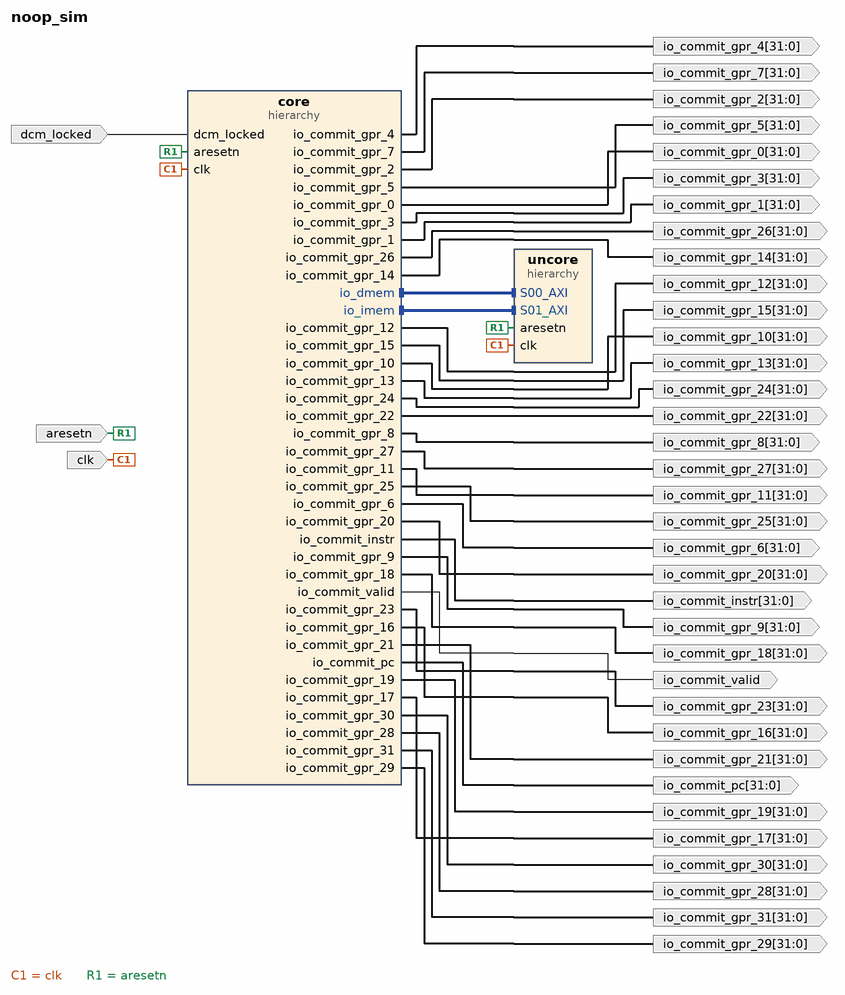
[diagram p0: block diagram of the top level]
# Vivado block design noop_sim, xc7a200tfbg676-2, Vivado 2018.1
create_bd_design noop_sim

create_bd_port -dir I -type clk clk
set_property -dict {CONFIG.FREQ_HZ 50000000 CONFIG.CLK_DOMAIN noop_sim_clk} [get_bd_ports clk]
create_bd_port -dir I -type rst aresetn
create_bd_port -dir O -from 31 -to 0 io_commit_gpr_26
create_bd_port -dir O -from 31 -to 0 io_commit_gpr_7
create_bd_port -dir O -from 31 -to 0 io_commit_gpr_4
create_bd_port -dir O io_commit_valid
create_bd_port -dir O -from 31 -to 0 io_commit_instr
create_bd_port -dir O -from 31 -to 0 io_commit_gpr_27
create_bd_port -dir O -from 31 -to 0 io_commit_gpr_5
create_bd_port -dir O -from 31 -to 0 io_commit_gpr_24
create_bd_port -dir O -from 31 -to 0 io_commit_gpr_25
create_bd_port -dir O -from 31 -to 0 io_commit_gpr_2
create_bd_port -dir O -from 31 -to 0 io_commit_gpr_22
create_bd_port -dir O -from 31 -to 0 io_commit_gpr_14
create_bd_port -dir O -from 31 -to 0 io_commit_pc
create_bd_port -dir O -from 31 -to 0 io_commit_gpr_3
create_bd_port -dir O -from 31 -to 0 io_commit_gpr_0
create_bd_port -dir O -from 31 -to 0 io_commit_gpr_15
create_bd_port -dir O -from 31 -to 0 io_commit_gpr_23
create_bd_port -dir O -from 31 -to 0 io_commit_gpr_20
create_bd_port -dir O -from 31 -to 0 io_commit_gpr_12
create_bd_port -dir O -from 31 -to 0 io_commit_gpr_1
create_bd_port -dir O -from 31 -to 0 io_commit_gpr_13
create_bd_port -dir O -from 31 -to 0 io_commit_gpr_21
create_bd_port -dir O -from 31 -to 0 io_commit_gpr_18
create_bd_port -dir O -from 31 -to 0 io_commit_gpr_10
create_bd_port -dir O -from 31 -to 0 io_commit_gpr_30
create_bd_port -dir O -from 31 -to 0 io_commit_gpr_11
create_bd_port -dir O -from 31 -to 0 io_commit_gpr_19
create_bd_port -dir O -from 31 -to 0 io_commit_gpr_16
create_bd_port -dir O -from 31 -to 0 io_commit_gpr_8
create_bd_port -dir O -from 31 -to 0 io_commit_gpr_31
create_bd_port -dir O -from 31 -to 0 io_commit_gpr_28
create_bd_port -dir O -from 31 -to 0 io_commit_gpr_9
create_bd_port -dir O -from 31 -to 0 io_commit_gpr_17
create_bd_port -dir O -from 31 -to 0 io_commit_gpr_6
create_bd_port -dir O -from 31 -to 0 io_commit_gpr_29
create_bd_port -dir I dcm_locked

create_bd_cell -type hier core
create_bd_cell -type hier uncore

# ---- hierarchy /core ----
current_bd_instance /core
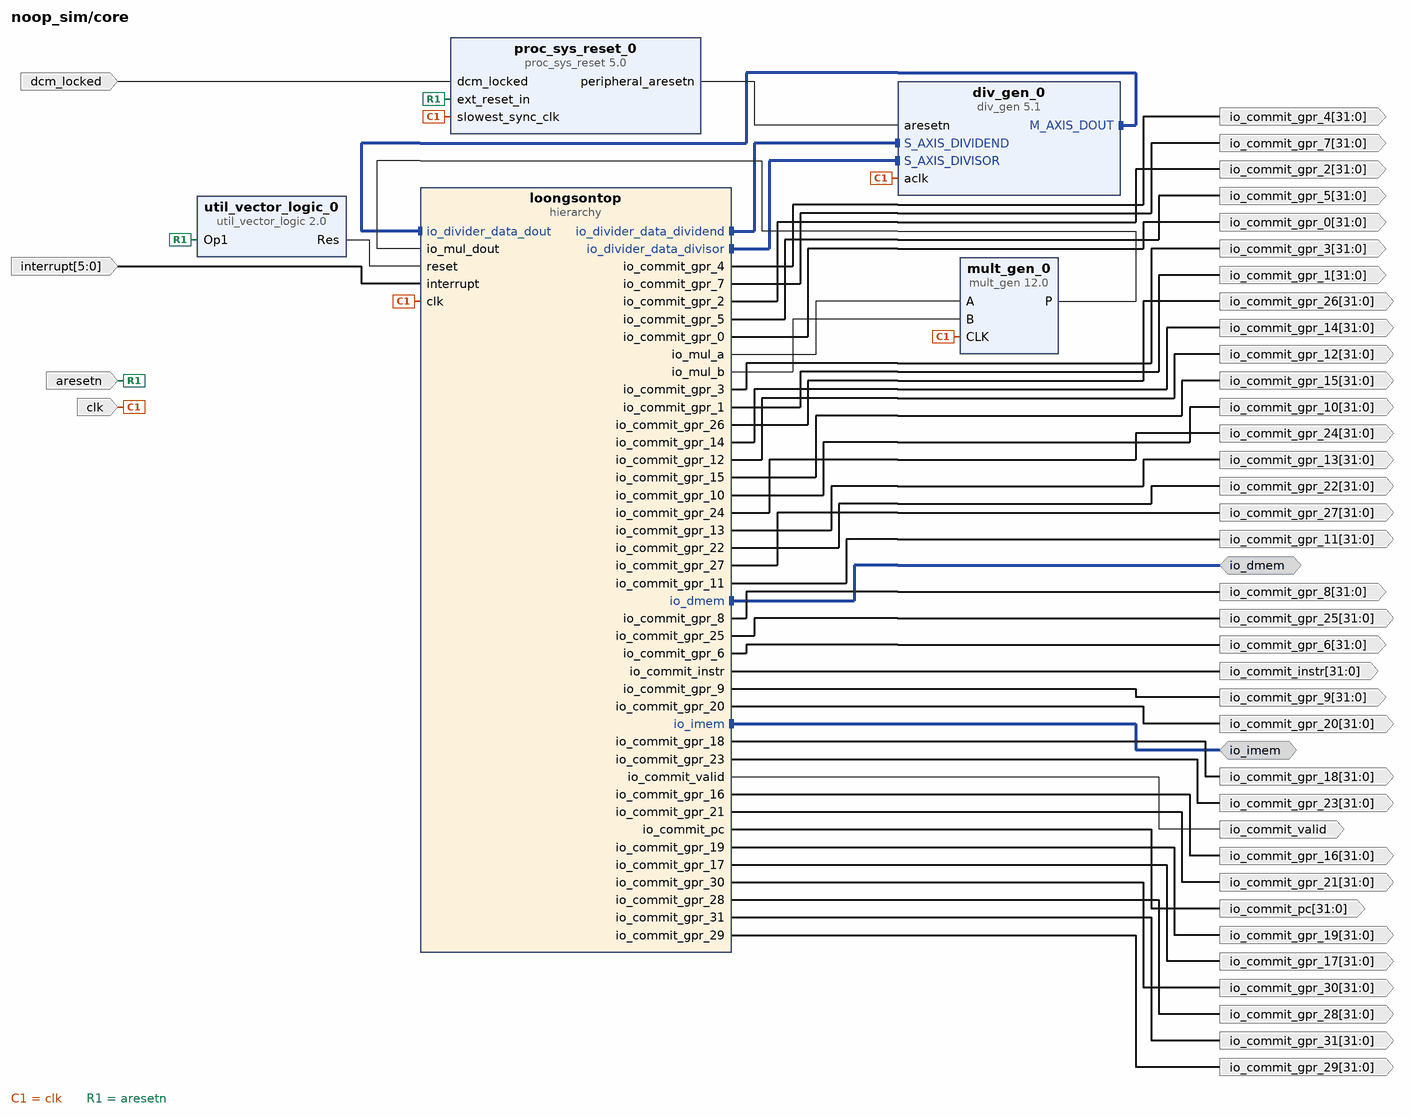
[diagram p1: block diagram inside /core]
create_bd_intf_pin -mode Master -vlnv xilinx.com:interface:aximm_rtl:1.0 io_dmem
create_bd_intf_pin -mode Master -vlnv xilinx.com:interface:aximm_rtl:1.0 io_imem
create_bd_pin -dir I -type clk clk
create_bd_pin -dir I -from 5 -to 0 interrupt
create_bd_pin -dir I -type rst aresetn
create_bd_pin -dir I dcm_locked
create_bd_pin -dir O -from 31 -to 0 io_commit_gpr_26
create_bd_pin -dir O -from 31 -to 0 io_commit_gpr_7
create_bd_pin -dir O -from 31 -to 0 io_commit_gpr_4
create_bd_pin -dir O io_commit_valid
create_bd_pin -dir O -from 31 -to 0 io_commit_instr
create_bd_pin -dir O -from 31 -to 0 io_commit_gpr_27
create_bd_pin -dir O -from 31 -to 0 io_commit_gpr_5
create_bd_pin -dir O -from 31 -to 0 io_commit_gpr_24
create_bd_pin -dir O -from 31 -to 0 io_commit_gpr_25
create_bd_pin -dir O -from 31 -to 0 io_commit_gpr_2
create_bd_pin -dir O -from 31 -to 0 io_commit_gpr_22
create_bd_pin -dir O -from 31 -to 0 io_commit_gpr_14
create_bd_pin -dir O -from 31 -to 0 io_commit_pc
create_bd_pin -dir O -from 31 -to 0 io_commit_gpr_3
create_bd_pin -dir O -from 31 -to 0 io_commit_gpr_0
create_bd_pin -dir O -from 31 -to 0 io_commit_gpr_15
create_bd_pin -dir O -from 31 -to 0 io_commit_gpr_23
create_bd_pin -dir O -from 31 -to 0 io_commit_gpr_20
create_bd_pin -dir O -from 31 -to 0 io_commit_gpr_12
create_bd_pin -dir O -from 31 -to 0 io_commit_gpr_1
create_bd_pin -dir O -from 31 -to 0 io_commit_gpr_13
create_bd_pin -dir O -from 31 -to 0 io_commit_gpr_21
create_bd_pin -dir O -from 31 -to 0 io_commit_gpr_18
create_bd_pin -dir O -from 31 -to 0 io_commit_gpr_10
create_bd_pin -dir O -from 31 -to 0 io_commit_gpr_30
create_bd_pin -dir O -from 31 -to 0 io_commit_gpr_11
create_bd_pin -dir O -from 31 -to 0 io_commit_gpr_19
create_bd_pin -dir O -from 31 -to 0 io_commit_gpr_16
create_bd_pin -dir O -from 31 -to 0 io_commit_gpr_8
create_bd_pin -dir O -from 31 -to 0 io_commit_gpr_31
create_bd_pin -dir O -from 31 -to 0 io_commit_gpr_28
create_bd_pin -dir O -from 31 -to 0 io_commit_gpr_9
create_bd_pin -dir O -from 31 -to 0 io_commit_gpr_17
create_bd_pin -dir O -from 31 -to 0 io_commit_gpr_6
create_bd_pin -dir O -from 31 -to 0 io_commit_gpr_29

create_bd_cell -type ip -vlnv xilinx.com:ip:util_vector_logic:2.0 util_vector_logic_0
set_property -dict {CONFIG.C_SIZE 1 CONFIG.C_OPERATION not} [get_bd_cells util_vector_logic_0]
create_bd_cell -type ip -vlnv xilinx.com:ip:mult_gen:12.0 mult_gen_0
set_property -dict [list \
  CONFIG.PortAType Signed \
  CONFIG.PortAWidth 33 \
  CONFIG.PortBWidth 33 \
  CONFIG.Multiplier_Construction Use_Mults \
  CONFIG.OptGoal Area \
  CONFIG.PipeStages 3 \
] [get_bd_cells mult_gen_0]
create_bd_cell -type ip -vlnv xilinx.com:ip:div_gen:5.1 div_gen_0
set_property -dict [list \
  CONFIG.dividend_and_quotient_width 40 \
  CONFIG.divisor_width 40 \
  CONFIG.fractional_width 40 \
  CONFIG.clocks_per_division 8 \
  CONFIG.FlowControl Blocking \
  CONFIG.OptimizeGoal Resources \
  CONFIG.latency 46 \
  CONFIG.ARESETN true \
] [get_bd_cells div_gen_0]
create_bd_cell -type ip -vlnv xilinx.com:ip:proc_sys_reset:5.0 proc_sys_reset_0
create_bd_cell -type hier loongsontop

# ---- hierarchy /core/loongsontop ----
current_bd_instance /core/loongsontop
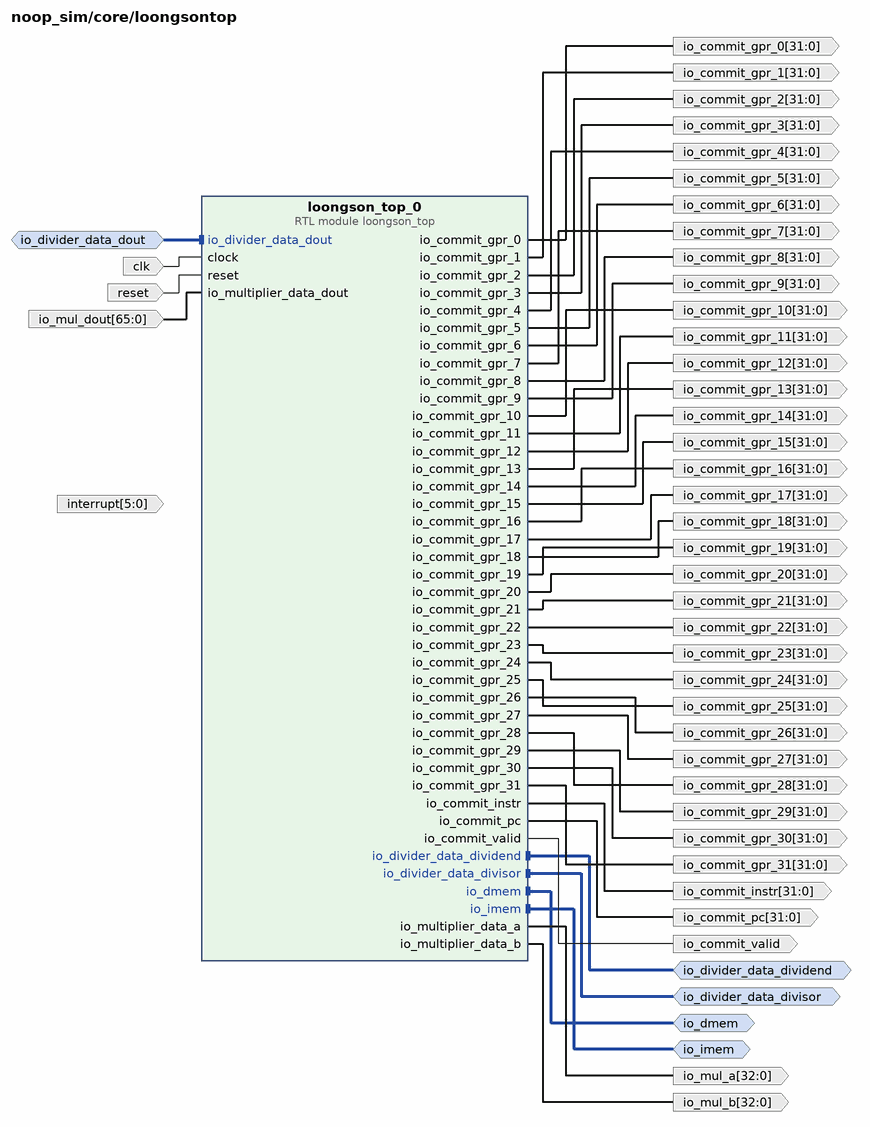
[diagram p2: block diagram inside /core/loongsontop]
create_bd_intf_pin -mode Master -vlnv xilinx.com:interface:aximm_rtl:1.0 io_dmem
create_bd_intf_pin -mode Master -vlnv xilinx.com:interface:aximm_rtl:1.0 io_imem
create_bd_intf_pin -mode Master -vlnv xilinx.com:interface:axis_rtl:1.0 io_divider_data_dividend
create_bd_intf_pin -mode Master -vlnv xilinx.com:interface:axis_rtl:1.0 io_divider_data_divisor
create_bd_intf_pin -mode Slave -vlnv xilinx.com:interface:axis_rtl:1.0 io_divider_data_dout
create_bd_pin -dir I -type clk clk
create_bd_pin -dir I -type rst reset
create_bd_pin -dir O -from 32 -to 0 io_mul_a
create_bd_pin -dir O -from 32 -to 0 io_mul_b
create_bd_pin -dir I -from 65 -to 0 io_mul_dout
create_bd_pin -dir I -from 5 -to 0 interrupt
create_bd_pin -dir O -from 31 -to 0 io_commit_gpr_26
create_bd_pin -dir O -from 31 -to 0 io_commit_gpr_7
create_bd_pin -dir O -from 31 -to 0 io_commit_gpr_4
create_bd_pin -dir O io_commit_valid
create_bd_pin -dir O -from 31 -to 0 io_commit_instr
create_bd_pin -dir O -from 31 -to 0 io_commit_gpr_27
create_bd_pin -dir O -from 31 -to 0 io_commit_gpr_5
create_bd_pin -dir O -from 31 -to 0 io_commit_gpr_24
create_bd_pin -dir O -from 31 -to 0 io_commit_gpr_25
create_bd_pin -dir O -from 31 -to 0 io_commit_gpr_2
create_bd_pin -dir O -from 31 -to 0 io_commit_gpr_22
create_bd_pin -dir O -from 31 -to 0 io_commit_gpr_14
create_bd_pin -dir O -from 31 -to 0 io_commit_pc
create_bd_pin -dir O -from 31 -to 0 io_commit_gpr_3
create_bd_pin -dir O -from 31 -to 0 io_commit_gpr_0
create_bd_pin -dir O -from 31 -to 0 io_commit_gpr_15
create_bd_pin -dir O -from 31 -to 0 io_commit_gpr_23
create_bd_pin -dir O -from 31 -to 0 io_commit_gpr_20
create_bd_pin -dir O -from 31 -to 0 io_commit_gpr_12
create_bd_pin -dir O -from 31 -to 0 io_commit_gpr_1
create_bd_pin -dir O -from 31 -to 0 io_commit_gpr_13
create_bd_pin -dir O -from 31 -to 0 io_commit_gpr_21
create_bd_pin -dir O -from 31 -to 0 io_commit_gpr_18
create_bd_pin -dir O -from 31 -to 0 io_commit_gpr_10
create_bd_pin -dir O -from 31 -to 0 io_commit_gpr_30
create_bd_pin -dir O -from 31 -to 0 io_commit_gpr_11
create_bd_pin -dir O -from 31 -to 0 io_commit_gpr_19
create_bd_pin -dir O -from 31 -to 0 io_commit_gpr_16
create_bd_pin -dir O -from 31 -to 0 io_commit_gpr_8
create_bd_pin -dir O -from 31 -to 0 io_commit_gpr_31
create_bd_pin -dir O -from 31 -to 0 io_commit_gpr_28
create_bd_pin -dir O -from 31 -to 0 io_commit_gpr_9
create_bd_pin -dir O -from 31 -to 0 io_commit_gpr_17
create_bd_pin -dir O -from 31 -to 0 io_commit_gpr_6
create_bd_pin -dir O -from 31 -to 0 io_commit_gpr_29

create_bd_cell -type module -reference loongson_top loongson_top_0

# ---- hierarchy /uncore ----
current_bd_instance /uncore
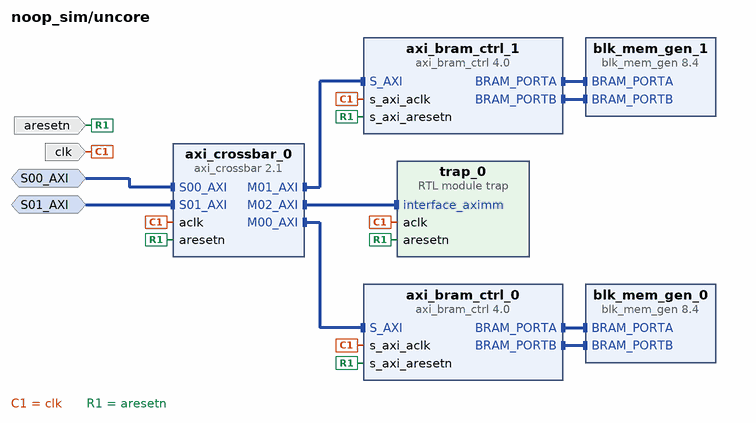
[diagram p3: block diagram inside /uncore]
create_bd_intf_pin -mode Slave -vlnv xilinx.com:interface:aximm_rtl:1.0 S00_AXI
create_bd_intf_pin -mode Slave -vlnv xilinx.com:interface:aximm_rtl:1.0 S01_AXI
create_bd_pin -dir I -type clk clk
create_bd_pin -dir I -type rst aresetn

create_bd_cell -type ip -vlnv xilinx.com:ip:axi_bram_ctrl:4.0 axi_bram_ctrl_0
set_property -dict {CONFIG.SINGLE_PORT_BRAM 0} [get_bd_cells axi_bram_ctrl_0]
create_bd_cell -type ip -vlnv xilinx.com:ip:axi_crossbar:2.1 axi_crossbar_0
set_property -dict [list \
  CONFIG.ADDR_RANGES 1 \
  CONFIG.NUM_SI 2 \
  CONFIG.NUM_MI 3 \
  CONFIG.M00_A00_BASE_ADDR 0x0000000000000000 \
  CONFIG.M00_A01_BASE_ADDR 0x000000001FC00000 \
  CONFIG.M01_A00_BASE_ADDR 0x000000001fc00000 \
  CONFIG.M02_A00_BASE_ADDR 0x0000000010000000 \
  CONFIG.M00_A00_ADDR_WIDTH 20 \
  CONFIG.M00_A01_ADDR_WIDTH 20 \
  CONFIG.M01_A00_ADDR_WIDTH 20 \
  CONFIG.M02_A00_ADDR_WIDTH 12 \
] [get_bd_cells axi_crossbar_0]
create_bd_cell -type ip -vlnv xilinx.com:ip:blk_mem_gen:8.4 blk_mem_gen_0
set_property -dict [list \
  CONFIG.Memory_Type True_Dual_Port_RAM \
  CONFIG.Enable_32bit_Address true \
  CONFIG.Write_Width_A 32 \
  CONFIG.Write_Depth_A 4096 \
  CONFIG.Read_Width_A 32 \
  CONFIG.Operating_Mode_A READ_FIRST \
  CONFIG.Write_Width_B 32 \
  CONFIG.Read_Width_B 32 \
  CONFIG.Operating_Mode_B READ_FIRST \
  CONFIG.Enable_B Use_ENB_Pin \
  CONFIG.Register_PortA_Output_of_Memory_Primitives false \
  CONFIG.Register_PortB_Output_of_Memory_Primitives false \
  CONFIG.Load_Init_File true \
  CONFIG.Coe_File ../../ddr.coe \
  CONFIG.Fill_Remaining_Memory_Locations false \
  CONFIG.Use_RSTA_Pin false \
  CONFIG.Use_RSTB_Pin false \
  CONFIG.Port_B_Clock 100 \
  CONFIG.Port_B_Write_Rate 50 \
  CONFIG.Port_B_Enable_Rate 100 \
  CONFIG.use_bram_block Stand_Alone \
] [get_bd_cells blk_mem_gen_0]
create_bd_cell -type ip -vlnv xilinx.com:ip:blk_mem_gen:8.4 blk_mem_gen_1
set_property -dict [list \
  CONFIG.Memory_Type True_Dual_Port_RAM \
  CONFIG.Enable_32bit_Address true \
  CONFIG.Write_Width_A 32 \
  CONFIG.Write_Depth_A 4096 \
  CONFIG.Read_Width_A 32 \
  CONFIG.Operating_Mode_A READ_FIRST \
  CONFIG.Write_Width_B 32 \
  CONFIG.Read_Width_B 32 \
  CONFIG.Operating_Mode_B READ_FIRST \
  CONFIG.Enable_B Use_ENB_Pin \
  CONFIG.Register_PortA_Output_of_Memory_Primitives false \
  CONFIG.Register_PortB_Output_of_Memory_Primitives false \
  CONFIG.Load_Init_File true \
  CONFIG.Coe_File ../../bram.coe \
  CONFIG.Fill_Remaining_Memory_Locations false \
  CONFIG.Use_RSTA_Pin false \
  CONFIG.Use_RSTB_Pin false \
  CONFIG.Port_B_Clock 100 \
  CONFIG.Port_B_Write_Rate 50 \
  CONFIG.Port_B_Enable_Rate 100 \
  CONFIG.use_bram_block Stand_Alone \
] [get_bd_cells blk_mem_gen_1]
create_bd_cell -type ip -vlnv xilinx.com:ip:axi_bram_ctrl:4.0 axi_bram_ctrl_1
set_property -dict {CONFIG.SINGLE_PORT_BRAM 0} [get_bd_cells axi_bram_ctrl_1]
create_bd_cell -type module -reference trap trap_0

# ---- connections ----

current_bd_instance /core
connect_bd_intf_net [get_bd_intf_pins loongsontop/io_divider_data_dividend] [get_bd_intf_pins div_gen_0/S_AXIS_DIVIDEND]
connect_bd_intf_net [get_bd_intf_pins loongsontop/io_divider_data_divisor] [get_bd_intf_pins div_gen_0/S_AXIS_DIVISOR]
connect_bd_intf_net [get_bd_intf_pins loongsontop/io_divider_data_dout] [get_bd_intf_pins div_gen_0/M_AXIS_DOUT]
connect_bd_intf_net -intf_net loongson_top_0_io_dmem1 [get_bd_intf_pins io_dmem] [get_bd_intf_pins loongsontop/io_dmem]
connect_bd_intf_net -intf_net loongson_top_0_io_imem1 [get_bd_intf_pins io_imem] [get_bd_intf_pins loongsontop/io_imem]
connect_bd_net [get_bd_pins util_vector_logic_0/Res] [get_bd_pins loongsontop/reset]
connect_bd_net -net loongson_top_0_io_mul_a [get_bd_pins loongsontop/io_mul_a] [get_bd_pins mult_gen_0/A]
connect_bd_net -net loongson_top_0_io_mul_b [get_bd_pins loongsontop/io_mul_b] [get_bd_pins mult_gen_0/B]
connect_bd_net [get_bd_pins mult_gen_0/P] [get_bd_pins loongsontop/io_mul_dout]
connect_bd_net [get_bd_pins proc_sys_reset_0/peripheral_aresetn] [get_bd_pins div_gen_0/aresetn]
connect_bd_net [get_bd_pins clk] \
  [get_bd_pins div_gen_0/aclk] [get_bd_pins mult_gen_0/CLK] [get_bd_pins proc_sys_reset_0/slowest_sync_clk] \
  [get_bd_pins loongsontop/clk]
connect_bd_net [get_bd_pins interrupt] [get_bd_pins loongsontop/interrupt]
connect_bd_net [get_bd_pins aresetn] [get_bd_pins proc_sys_reset_0/ext_reset_in] [get_bd_pins util_vector_logic_0/Op1]
connect_bd_net [get_bd_pins dcm_locked] [get_bd_pins proc_sys_reset_0/dcm_locked]
connect_bd_net -net loongsontop_io_commit_gpr_26_0 [get_bd_pins loongsontop/io_commit_gpr_26] [get_bd_pins io_commit_gpr_26]
connect_bd_net -net loongsontop_io_commit_gpr_7_0 [get_bd_pins loongsontop/io_commit_gpr_7] [get_bd_pins io_commit_gpr_7]
connect_bd_net -net loongsontop_io_commit_gpr_4_0 [get_bd_pins loongsontop/io_commit_gpr_4] [get_bd_pins io_commit_gpr_4]
connect_bd_net [get_bd_pins loongsontop/io_commit_valid] [get_bd_pins io_commit_valid]
connect_bd_net [get_bd_pins loongsontop/io_commit_instr] [get_bd_pins io_commit_instr]
connect_bd_net -net loongsontop_io_commit_gpr_27_0 [get_bd_pins loongsontop/io_commit_gpr_27] [get_bd_pins io_commit_gpr_27]
connect_bd_net -net loongsontop_io_commit_gpr_5_0 [get_bd_pins loongsontop/io_commit_gpr_5] [get_bd_pins io_commit_gpr_5]
connect_bd_net -net loongsontop_io_commit_gpr_24_0 [get_bd_pins loongsontop/io_commit_gpr_24] [get_bd_pins io_commit_gpr_24]
connect_bd_net -net loongsontop_io_commit_gpr_25_0 [get_bd_pins loongsontop/io_commit_gpr_25] [get_bd_pins io_commit_gpr_25]
connect_bd_net -net loongsontop_io_commit_gpr_2_0 [get_bd_pins loongsontop/io_commit_gpr_2] [get_bd_pins io_commit_gpr_2]
connect_bd_net -net loongsontop_io_commit_gpr_22_0 [get_bd_pins loongsontop/io_commit_gpr_22] [get_bd_pins io_commit_gpr_22]
connect_bd_net -net loongsontop_io_commit_gpr_14_0 [get_bd_pins loongsontop/io_commit_gpr_14] [get_bd_pins io_commit_gpr_14]
connect_bd_net [get_bd_pins loongsontop/io_commit_pc] [get_bd_pins io_commit_pc]
connect_bd_net -net loongsontop_io_commit_gpr_3_0 [get_bd_pins loongsontop/io_commit_gpr_3] [get_bd_pins io_commit_gpr_3]
connect_bd_net -net loongsontop_io_commit_gpr_0_0 [get_bd_pins loongsontop/io_commit_gpr_0] [get_bd_pins io_commit_gpr_0]
connect_bd_net -net loongsontop_io_commit_gpr_15_0 [get_bd_pins loongsontop/io_commit_gpr_15] [get_bd_pins io_commit_gpr_15]
connect_bd_net -net loongsontop_io_commit_gpr_23_0 [get_bd_pins loongsontop/io_commit_gpr_23] [get_bd_pins io_commit_gpr_23]
connect_bd_net -net loongsontop_io_commit_gpr_20_0 [get_bd_pins loongsontop/io_commit_gpr_20] [get_bd_pins io_commit_gpr_20]
connect_bd_net -net loongsontop_io_commit_gpr_12_0 [get_bd_pins loongsontop/io_commit_gpr_12] [get_bd_pins io_commit_gpr_12]
connect_bd_net -net loongsontop_io_commit_gpr_1_0 [get_bd_pins loongsontop/io_commit_gpr_1] [get_bd_pins io_commit_gpr_1]
connect_bd_net -net loongsontop_io_commit_gpr_13_0 [get_bd_pins loongsontop/io_commit_gpr_13] [get_bd_pins io_commit_gpr_13]
connect_bd_net -net loongsontop_io_commit_gpr_21_0 [get_bd_pins loongsontop/io_commit_gpr_21] [get_bd_pins io_commit_gpr_21]
connect_bd_net -net loongsontop_io_commit_gpr_18_0 [get_bd_pins loongsontop/io_commit_gpr_18] [get_bd_pins io_commit_gpr_18]
connect_bd_net -net loongsontop_io_commit_gpr_10_0 [get_bd_pins loongsontop/io_commit_gpr_10] [get_bd_pins io_commit_gpr_10]
connect_bd_net -net loongsontop_io_commit_gpr_30_0 [get_bd_pins loongsontop/io_commit_gpr_30] [get_bd_pins io_commit_gpr_30]
connect_bd_net -net loongsontop_io_commit_gpr_11_0 [get_bd_pins loongsontop/io_commit_gpr_11] [get_bd_pins io_commit_gpr_11]
connect_bd_net -net loongsontop_io_commit_gpr_19_0 [get_bd_pins loongsontop/io_commit_gpr_19] [get_bd_pins io_commit_gpr_19]
connect_bd_net -net loongsontop_io_commit_gpr_16_0 [get_bd_pins loongsontop/io_commit_gpr_16] [get_bd_pins io_commit_gpr_16]
connect_bd_net -net loongsontop_io_commit_gpr_8_0 [get_bd_pins loongsontop/io_commit_gpr_8] [get_bd_pins io_commit_gpr_8]
connect_bd_net -net loongsontop_io_commit_gpr_31_0 [get_bd_pins loongsontop/io_commit_gpr_31] [get_bd_pins io_commit_gpr_31]
connect_bd_net -net loongsontop_io_commit_gpr_28_0 [get_bd_pins loongsontop/io_commit_gpr_28] [get_bd_pins io_commit_gpr_28]
connect_bd_net -net loongsontop_io_commit_gpr_9_0 [get_bd_pins loongsontop/io_commit_gpr_9] [get_bd_pins io_commit_gpr_9]
connect_bd_net -net loongsontop_io_commit_gpr_17_0 [get_bd_pins loongsontop/io_commit_gpr_17] [get_bd_pins io_commit_gpr_17]
connect_bd_net -net loongsontop_io_commit_gpr_6_0 [get_bd_pins loongsontop/io_commit_gpr_6] [get_bd_pins io_commit_gpr_6]
connect_bd_net -net loongsontop_io_commit_gpr_29_0 [get_bd_pins loongsontop/io_commit_gpr_29] [get_bd_pins io_commit_gpr_29]

current_bd_instance /core/loongsontop
connect_bd_intf_net [get_bd_intf_pins io_dmem] [get_bd_intf_pins loongson_top_0/io_dmem]
connect_bd_intf_net [get_bd_intf_pins io_imem] [get_bd_intf_pins loongson_top_0/io_imem]
connect_bd_intf_net [get_bd_intf_pins io_divider_data_dividend] [get_bd_intf_pins loongson_top_0/io_divider_data_dividend]
connect_bd_intf_net [get_bd_intf_pins io_divider_data_divisor] [get_bd_intf_pins loongson_top_0/io_divider_data_divisor]
connect_bd_intf_net [get_bd_intf_pins io_divider_data_dout] [get_bd_intf_pins loongson_top_0/io_divider_data_dout]
connect_bd_net [get_bd_pins clk] [get_bd_pins loongson_top_0/clock]
connect_bd_net [get_bd_pins reset] [get_bd_pins loongson_top_0/reset]
# net interrupt_1 has one end: interrupt
connect_bd_net [get_bd_pins io_mul_dout] [get_bd_pins loongson_top_0/io_multiplier_data_dout]
connect_bd_net -net loongson_top_0_io_mul_a [get_bd_pins loongson_top_0/io_multiplier_data_a] [get_bd_pins io_mul_a]
connect_bd_net -net loongson_top_0_io_mul_b [get_bd_pins loongson_top_0/io_multiplier_data_b] [get_bd_pins io_mul_b]
connect_bd_net [get_bd_pins loongson_top_0/io_commit_gpr_26] [get_bd_pins io_commit_gpr_26]
connect_bd_net [get_bd_pins loongson_top_0/io_commit_gpr_7] [get_bd_pins io_commit_gpr_7]
connect_bd_net [get_bd_pins loongson_top_0/io_commit_gpr_4] [get_bd_pins io_commit_gpr_4]
connect_bd_net [get_bd_pins loongson_top_0/io_commit_valid] [get_bd_pins io_commit_valid]
connect_bd_net [get_bd_pins loongson_top_0/io_commit_instr] [get_bd_pins io_commit_instr]
connect_bd_net [get_bd_pins loongson_top_0/io_commit_gpr_27] [get_bd_pins io_commit_gpr_27]
connect_bd_net [get_bd_pins loongson_top_0/io_commit_gpr_5] [get_bd_pins io_commit_gpr_5]
connect_bd_net [get_bd_pins loongson_top_0/io_commit_gpr_24] [get_bd_pins io_commit_gpr_24]
connect_bd_net [get_bd_pins loongson_top_0/io_commit_gpr_25] [get_bd_pins io_commit_gpr_25]
connect_bd_net [get_bd_pins loongson_top_0/io_commit_gpr_2] [get_bd_pins io_commit_gpr_2]
connect_bd_net [get_bd_pins loongson_top_0/io_commit_gpr_22] [get_bd_pins io_commit_gpr_22]
connect_bd_net [get_bd_pins loongson_top_0/io_commit_gpr_14] [get_bd_pins io_commit_gpr_14]
connect_bd_net [get_bd_pins loongson_top_0/io_commit_pc] [get_bd_pins io_commit_pc]
connect_bd_net [get_bd_pins loongson_top_0/io_commit_gpr_3] [get_bd_pins io_commit_gpr_3]
connect_bd_net [get_bd_pins loongson_top_0/io_commit_gpr_0] [get_bd_pins io_commit_gpr_0]
connect_bd_net [get_bd_pins loongson_top_0/io_commit_gpr_15] [get_bd_pins io_commit_gpr_15]
connect_bd_net [get_bd_pins loongson_top_0/io_commit_gpr_23] [get_bd_pins io_commit_gpr_23]
connect_bd_net [get_bd_pins loongson_top_0/io_commit_gpr_20] [get_bd_pins io_commit_gpr_20]
connect_bd_net [get_bd_pins loongson_top_0/io_commit_gpr_12] [get_bd_pins io_commit_gpr_12]
connect_bd_net [get_bd_pins loongson_top_0/io_commit_gpr_1] [get_bd_pins io_commit_gpr_1]
connect_bd_net [get_bd_pins loongson_top_0/io_commit_gpr_13] [get_bd_pins io_commit_gpr_13]
connect_bd_net [get_bd_pins loongson_top_0/io_commit_gpr_21] [get_bd_pins io_commit_gpr_21]
connect_bd_net [get_bd_pins loongson_top_0/io_commit_gpr_18] [get_bd_pins io_commit_gpr_18]
connect_bd_net [get_bd_pins loongson_top_0/io_commit_gpr_10] [get_bd_pins io_commit_gpr_10]
connect_bd_net [get_bd_pins loongson_top_0/io_commit_gpr_30] [get_bd_pins io_commit_gpr_30]
connect_bd_net [get_bd_pins loongson_top_0/io_commit_gpr_11] [get_bd_pins io_commit_gpr_11]
connect_bd_net [get_bd_pins loongson_top_0/io_commit_gpr_19] [get_bd_pins io_commit_gpr_19]
connect_bd_net [get_bd_pins loongson_top_0/io_commit_gpr_16] [get_bd_pins io_commit_gpr_16]
connect_bd_net [get_bd_pins loongson_top_0/io_commit_gpr_8] [get_bd_pins io_commit_gpr_8]
connect_bd_net [get_bd_pins loongson_top_0/io_commit_gpr_31] [get_bd_pins io_commit_gpr_31]
connect_bd_net [get_bd_pins loongson_top_0/io_commit_gpr_28] [get_bd_pins io_commit_gpr_28]
connect_bd_net [get_bd_pins loongson_top_0/io_commit_gpr_9] [get_bd_pins io_commit_gpr_9]
connect_bd_net [get_bd_pins loongson_top_0/io_commit_gpr_17] [get_bd_pins io_commit_gpr_17]
connect_bd_net [get_bd_pins loongson_top_0/io_commit_gpr_6] [get_bd_pins io_commit_gpr_6]
connect_bd_net [get_bd_pins loongson_top_0/io_commit_gpr_29] [get_bd_pins io_commit_gpr_29]

current_bd_instance /uncore
connect_bd_intf_net [get_bd_intf_pins axi_bram_ctrl_0/S_AXI] [get_bd_intf_pins axi_crossbar_0/M00_AXI]
connect_bd_intf_net [get_bd_intf_pins axi_bram_ctrl_0/BRAM_PORTA] [get_bd_intf_pins blk_mem_gen_0/BRAM_PORTA]
connect_bd_intf_net [get_bd_intf_pins axi_bram_ctrl_0/BRAM_PORTB] [get_bd_intf_pins blk_mem_gen_0/BRAM_PORTB]
connect_bd_intf_net [get_bd_intf_pins axi_crossbar_0/M02_AXI] [get_bd_intf_pins trap_0/interface_aximm]
connect_bd_intf_net [get_bd_intf_pins axi_crossbar_0/M01_AXI] [get_bd_intf_pins axi_bram_ctrl_1/S_AXI]
connect_bd_intf_net [get_bd_intf_pins axi_bram_ctrl_1/BRAM_PORTA] [get_bd_intf_pins blk_mem_gen_1/BRAM_PORTA]
connect_bd_intf_net [get_bd_intf_pins axi_bram_ctrl_1/BRAM_PORTB] [get_bd_intf_pins blk_mem_gen_1/BRAM_PORTB]
connect_bd_intf_net -intf_net core_io_dmem [get_bd_intf_pins S00_AXI] [get_bd_intf_pins axi_crossbar_0/S00_AXI]
connect_bd_intf_net -intf_net core_io_imem [get_bd_intf_pins S01_AXI] [get_bd_intf_pins axi_crossbar_0/S01_AXI]
connect_bd_net -net clk_0_1 [get_bd_pins clk] \
  [get_bd_pins axi_crossbar_0/aclk] [get_bd_pins axi_bram_ctrl_0/s_axi_aclk] [get_bd_pins axi_bram_ctrl_1/s_axi_aclk] \
  [get_bd_pins trap_0/aclk]
connect_bd_net -net aresetn_0_1 [get_bd_pins aresetn] \
  [get_bd_pins axi_crossbar_0/aresetn] [get_bd_pins axi_bram_ctrl_0/s_axi_aresetn] \
  [get_bd_pins axi_bram_ctrl_1/s_axi_aresetn] [get_bd_pins trap_0/aresetn]

current_bd_instance /
connect_bd_intf_net [get_bd_intf_pins core/io_dmem] [get_bd_intf_pins uncore/S00_AXI]
connect_bd_intf_net [get_bd_intf_pins core/io_imem] [get_bd_intf_pins uncore/S01_AXI]
connect_bd_net -net clk_0_1 [get_bd_ports clk] [get_bd_pins core/clk] [get_bd_pins uncore/clk]
connect_bd_net -net aresetn_0_1 [get_bd_ports aresetn] [get_bd_pins core/aresetn] [get_bd_pins uncore/aresetn]
connect_bd_net -net core_io_commit_gpr_26_0 [get_bd_pins core/io_commit_gpr_26] [get_bd_ports io_commit_gpr_26]
connect_bd_net -net core_io_commit_gpr_7_0 [get_bd_pins core/io_commit_gpr_7] [get_bd_ports io_commit_gpr_7]
connect_bd_net -net core_io_commit_gpr_4_0 [get_bd_pins core/io_commit_gpr_4] [get_bd_ports io_commit_gpr_4]
connect_bd_net [get_bd_pins core/io_commit_valid] [get_bd_ports io_commit_valid]
connect_bd_net [get_bd_pins core/io_commit_instr] [get_bd_ports io_commit_instr]
connect_bd_net -net core_io_commit_gpr_27_0 [get_bd_pins core/io_commit_gpr_27] [get_bd_ports io_commit_gpr_27]
connect_bd_net -net core_io_commit_gpr_5_0 [get_bd_pins core/io_commit_gpr_5] [get_bd_ports io_commit_gpr_5]
connect_bd_net -net core_io_commit_gpr_24_0 [get_bd_pins core/io_commit_gpr_24] [get_bd_ports io_commit_gpr_24]
connect_bd_net -net core_io_commit_gpr_25_0 [get_bd_pins core/io_commit_gpr_25] [get_bd_ports io_commit_gpr_25]
connect_bd_net -net core_io_commit_gpr_2_0 [get_bd_pins core/io_commit_gpr_2] [get_bd_ports io_commit_gpr_2]
connect_bd_net -net core_io_commit_gpr_22_0 [get_bd_pins core/io_commit_gpr_22] [get_bd_ports io_commit_gpr_22]
connect_bd_net -net core_io_commit_gpr_14_0 [get_bd_pins core/io_commit_gpr_14] [get_bd_ports io_commit_gpr_14]
connect_bd_net [get_bd_pins core/io_commit_pc] [get_bd_ports io_commit_pc]
connect_bd_net -net core_io_commit_gpr_3_0 [get_bd_pins core/io_commit_gpr_3] [get_bd_ports io_commit_gpr_3]
connect_bd_net -net core_io_commit_gpr_0_0 [get_bd_pins core/io_commit_gpr_0] [get_bd_ports io_commit_gpr_0]
connect_bd_net -net core_io_commit_gpr_15_0 [get_bd_pins core/io_commit_gpr_15] [get_bd_ports io_commit_gpr_15]
connect_bd_net -net core_io_commit_gpr_23_0 [get_bd_pins core/io_commit_gpr_23] [get_bd_ports io_commit_gpr_23]
connect_bd_net -net core_io_commit_gpr_20_0 [get_bd_pins core/io_commit_gpr_20] [get_bd_ports io_commit_gpr_20]
connect_bd_net -net core_io_commit_gpr_12_0 [get_bd_pins core/io_commit_gpr_12] [get_bd_ports io_commit_gpr_12]
connect_bd_net -net core_io_commit_gpr_1_0 [get_bd_pins core/io_commit_gpr_1] [get_bd_ports io_commit_gpr_1]
connect_bd_net -net core_io_commit_gpr_13_0 [get_bd_pins core/io_commit_gpr_13] [get_bd_ports io_commit_gpr_13]
connect_bd_net -net core_io_commit_gpr_21_0 [get_bd_pins core/io_commit_gpr_21] [get_bd_ports io_commit_gpr_21]
connect_bd_net -net core_io_commit_gpr_18_0 [get_bd_pins core/io_commit_gpr_18] [get_bd_ports io_commit_gpr_18]
connect_bd_net -net core_io_commit_gpr_10_0 [get_bd_pins core/io_commit_gpr_10] [get_bd_ports io_commit_gpr_10]
connect_bd_net -net core_io_commit_gpr_30_0 [get_bd_pins core/io_commit_gpr_30] [get_bd_ports io_commit_gpr_30]
connect_bd_net -net core_io_commit_gpr_11_0 [get_bd_pins core/io_commit_gpr_11] [get_bd_ports io_commit_gpr_11]
connect_bd_net -net core_io_commit_gpr_19_0 [get_bd_pins core/io_commit_gpr_19] [get_bd_ports io_commit_gpr_19]
connect_bd_net -net core_io_commit_gpr_16_0 [get_bd_pins core/io_commit_gpr_16] [get_bd_ports io_commit_gpr_16]
connect_bd_net -net core_io_commit_gpr_8_0 [get_bd_pins core/io_commit_gpr_8] [get_bd_ports io_commit_gpr_8]
connect_bd_net -net core_io_commit_gpr_31_0 [get_bd_pins core/io_commit_gpr_31] [get_bd_ports io_commit_gpr_31]
connect_bd_net -net core_io_commit_gpr_28_0 [get_bd_pins core/io_commit_gpr_28] [get_bd_ports io_commit_gpr_28]
connect_bd_net -net core_io_commit_gpr_9_0 [get_bd_pins core/io_commit_gpr_9] [get_bd_ports io_commit_gpr_9]
connect_bd_net -net core_io_commit_gpr_17_0 [get_bd_pins core/io_commit_gpr_17] [get_bd_ports io_commit_gpr_17]
connect_bd_net -net core_io_commit_gpr_6_0 [get_bd_pins core/io_commit_gpr_6] [get_bd_ports io_commit_gpr_6]
connect_bd_net -net core_io_commit_gpr_29_0 [get_bd_pins core/io_commit_gpr_29] [get_bd_ports io_commit_gpr_29]
connect_bd_net -net dcm_locked_0_1 [get_bd_ports dcm_locked] [get_bd_pins core/dcm_locked]

# ---- address map ----
assign_bd_address -offset 0x00000000 -range 1M -target_address_space [get_bd_addr_spaces core/loongsontop/loongson_top_0/io_dmem] [get_bd_addr_segs uncore/axi_bram_ctrl_0/S_AXI/Mem0]
assign_bd_address -offset 0x10000000 -range 4K -target_address_space [get_bd_addr_spaces core/loongsontop/loongson_top_0/io_dmem] [get_bd_addr_segs uncore/trap_0/interface_aximm/reg0]
assign_bd_address -offset 0x1FC00000 -range 1M -target_address_space [get_bd_addr_spaces core/loongsontop/loongson_top_0/io_dmem] [get_bd_addr_segs uncore/axi_bram_ctrl_1/S_AXI/Mem0]
assign_bd_address -offset 0x00000000 -range 1M -target_address_space [get_bd_addr_spaces core/loongsontop/loongson_top_0/io_imem] [get_bd_addr_segs uncore/axi_bram_ctrl_0/S_AXI/Mem0]
assign_bd_address -offset 0x10000000 -range 4K -target_address_space [get_bd_addr_spaces core/loongsontop/loongson_top_0/io_imem] [get_bd_addr_segs uncore/trap_0/interface_aximm/reg0]
assign_bd_address -offset 0x1FC00000 -range 1M -target_address_space [get_bd_addr_spaces core/loongsontop/loongson_top_0/io_imem] [get_bd_addr_segs uncore/axi_bram_ctrl_1/S_AXI/Mem0]

validate_bd_design
save_bd_design
